# Altium project ADC_HUB.PrjPcb
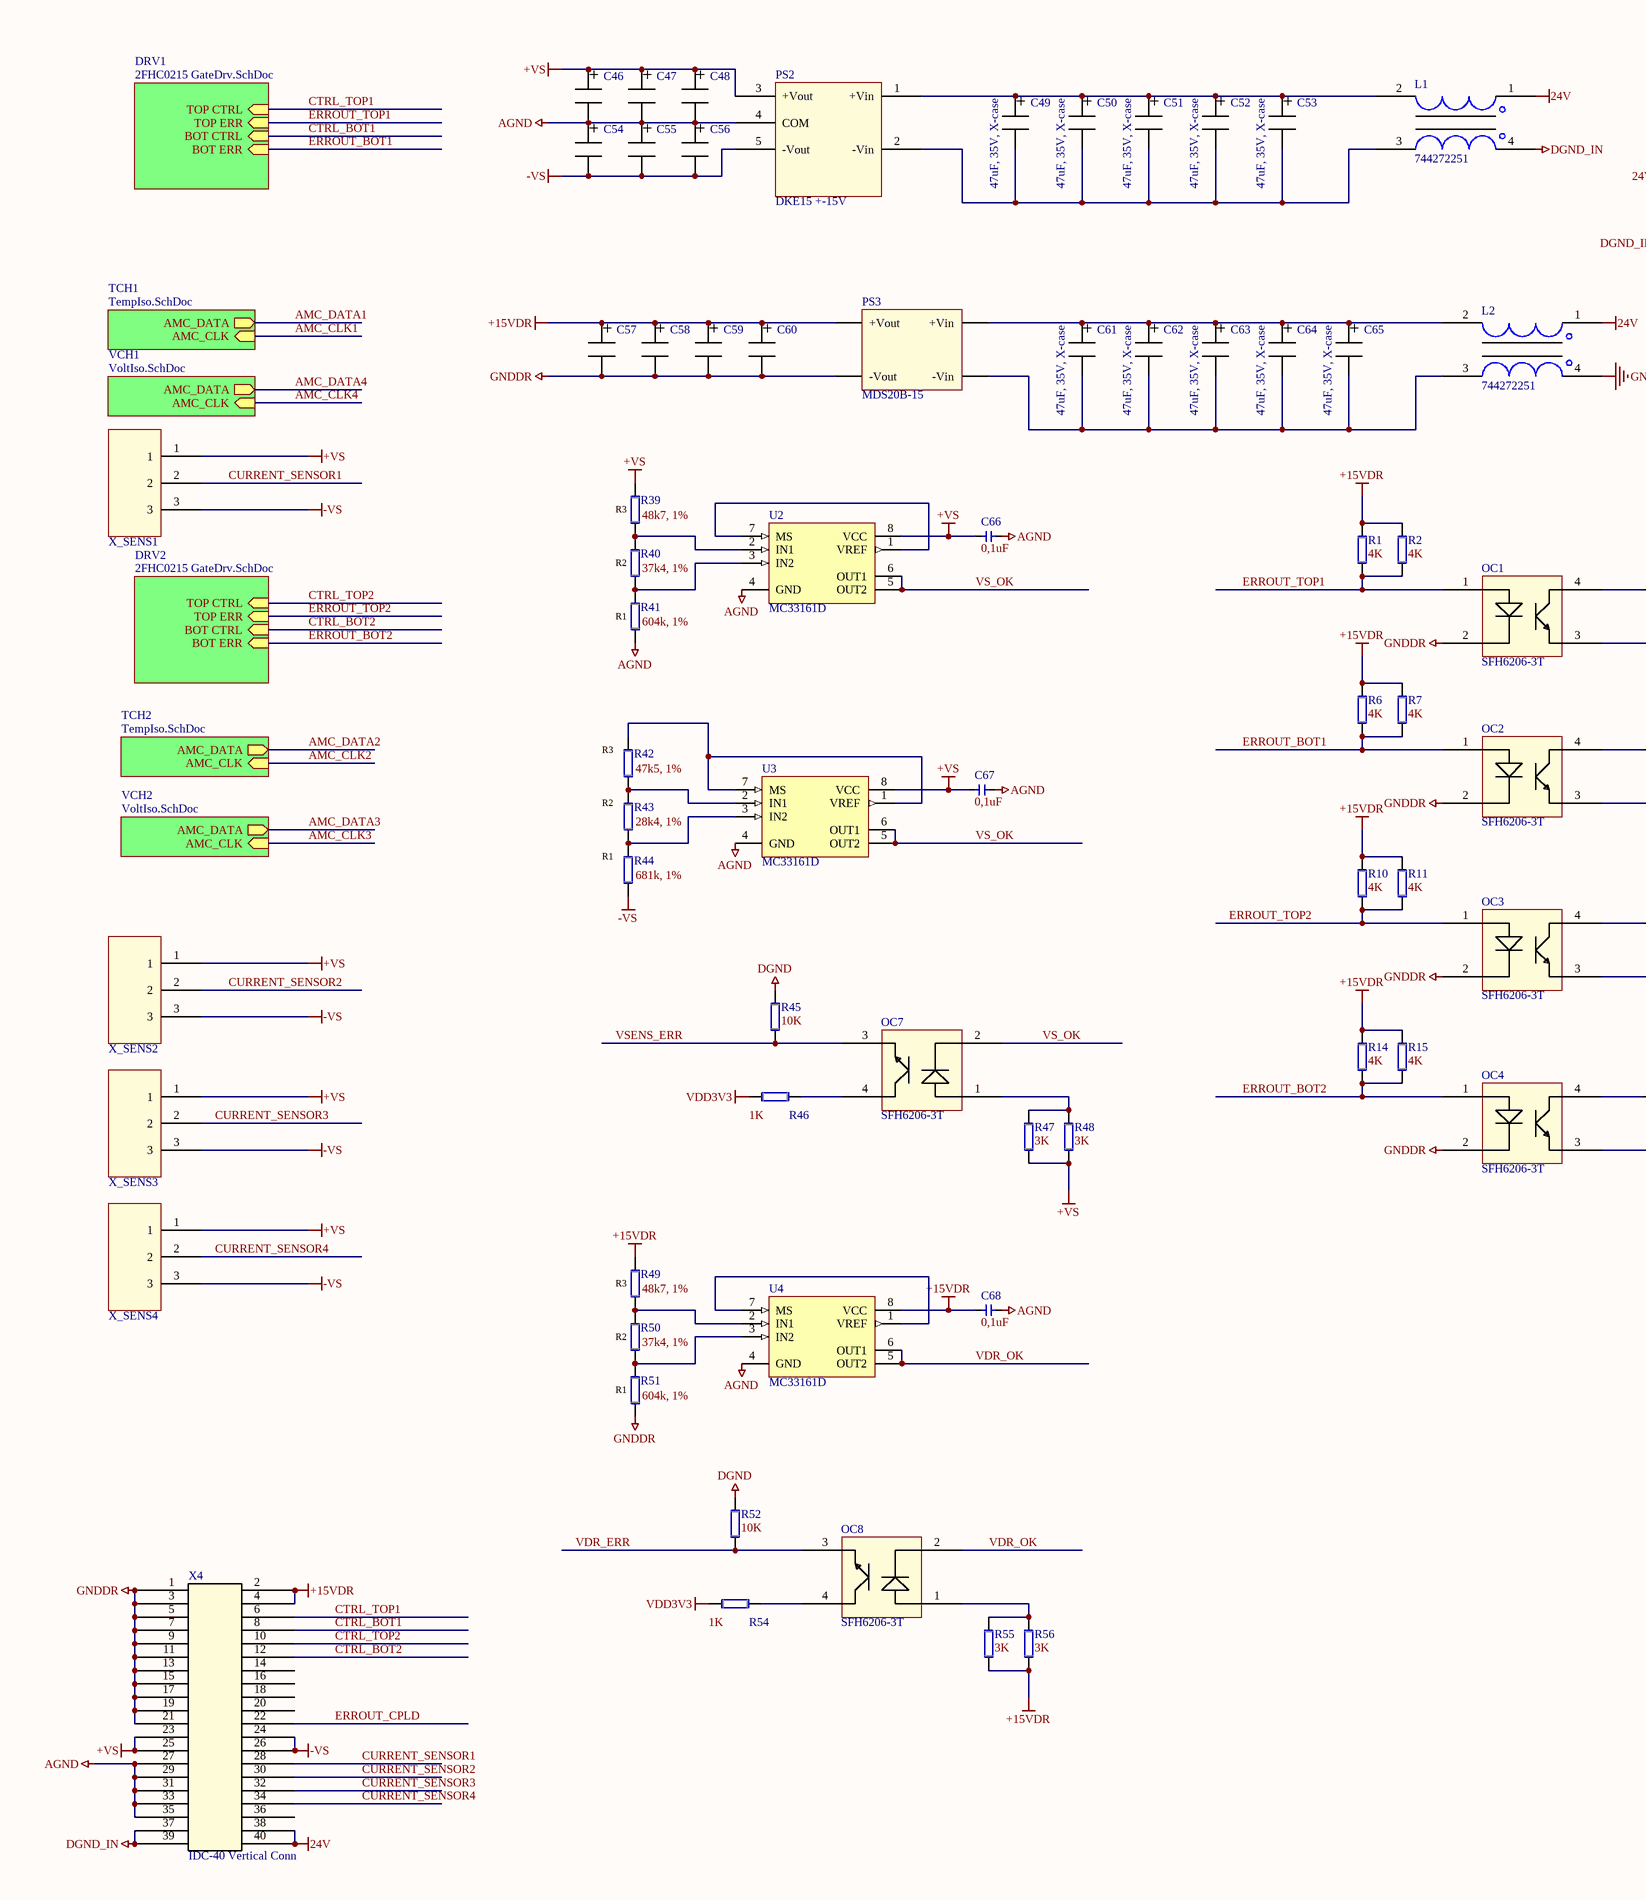
[diagram p0: ADC_HUB.SchDoc, left]
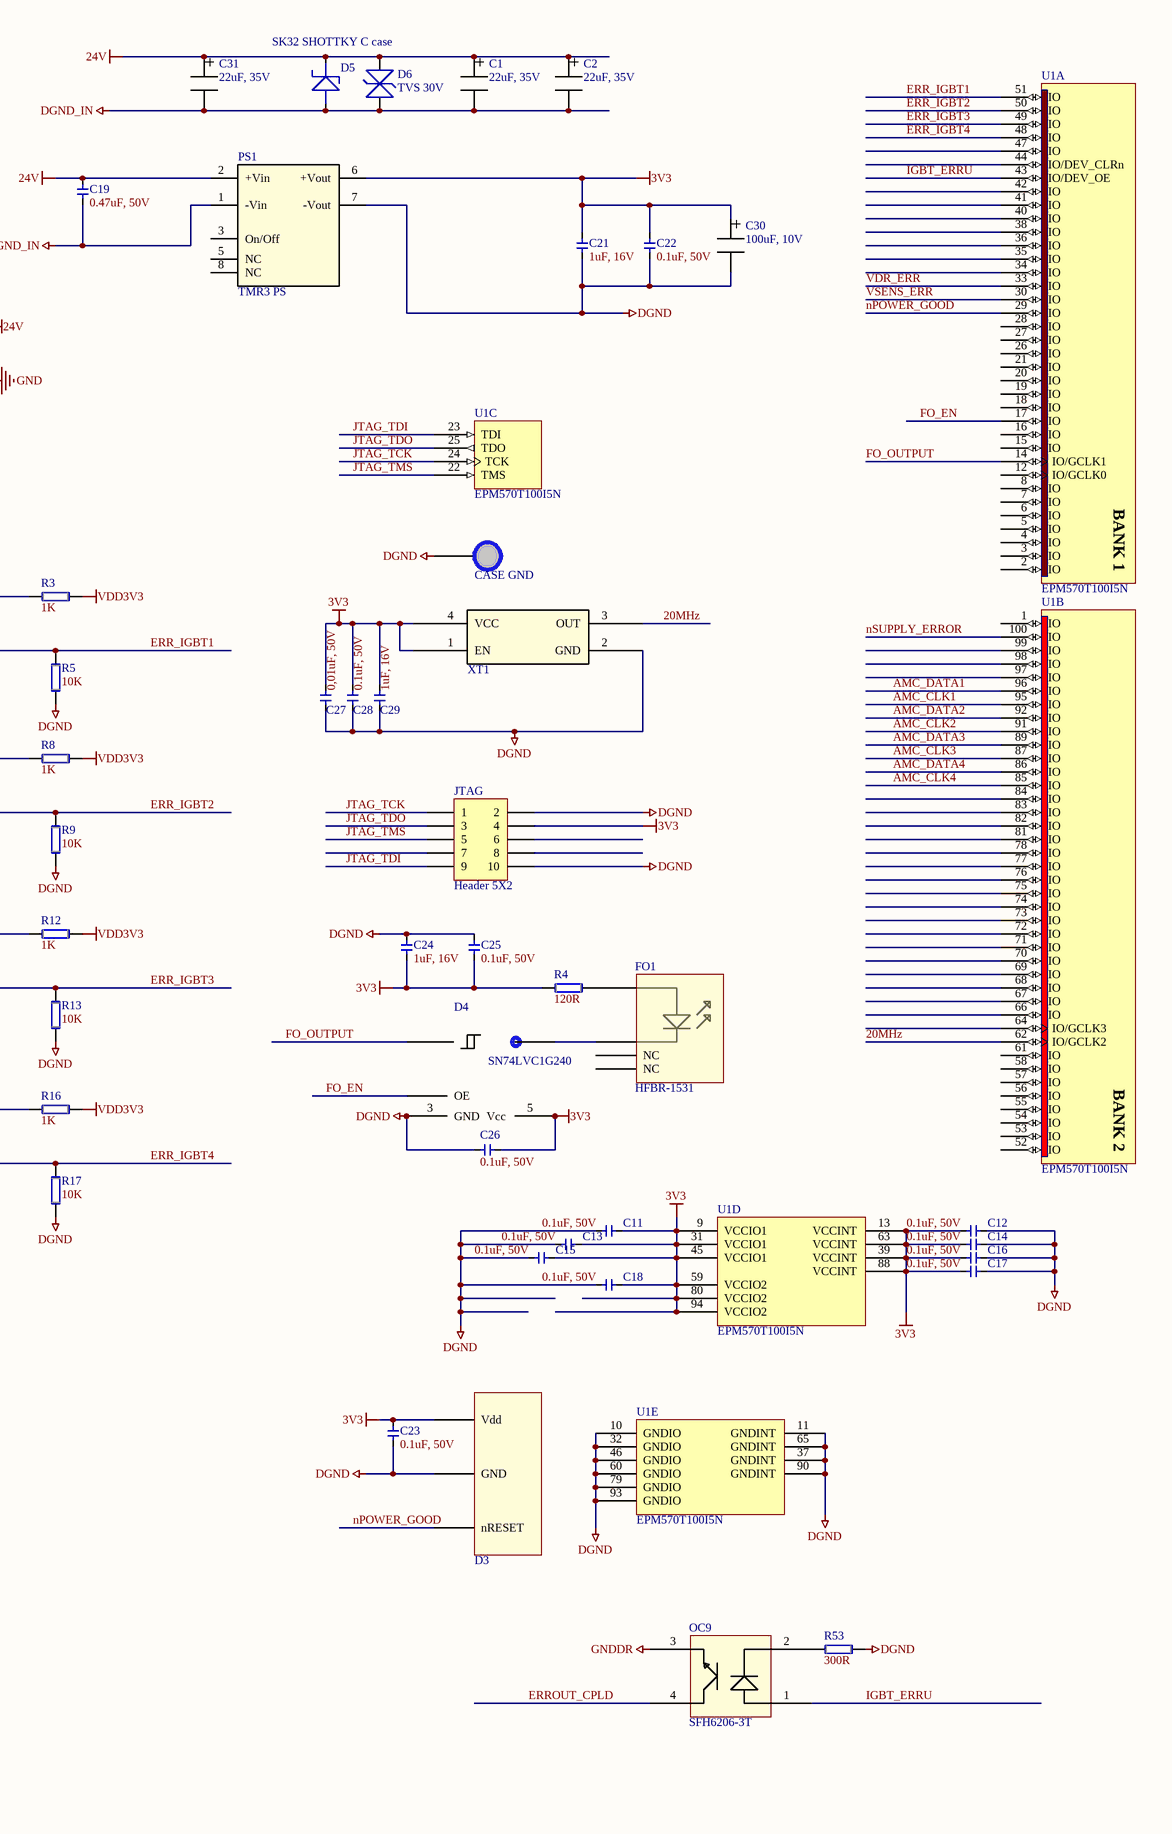
[diagram p1: ADC_HUB.SchDoc, right]
1 sheet, 109 parts. Net scope: hierarchical (ports join the sheet entries above them; power ports are global).
Board file: ADC_HUB.PcbDoc

## Sheet ADC_HUB.SchDoc
size A2

### Parts
C1  value 22uF, 35V  [D]  (hidden comment: Tant Cap D-case)
C2  value 22uF, 35V  [D]  (hidden comment: Tant Cap D-case)
C11  value 0.1uF, 50V  [SMD CAP 0805]  (hidden comment: ChipCap)
C12  value 0.1uF, 50V  [SMD CAP 0805]  (hidden comment: ChipCap)
C13  value 0.1uF, 50V  [SMD CAP 0805]  (hidden comment: ChipCap)
C14  value 0.1uF, 50V  [SMD CAP 0805]  (hidden comment: ChipCap)
C15  value 0.1uF, 50V  [SMD CAP 0805]  (hidden comment: ChipCap)
C16  value 0.1uF, 50V  [SMD CAP 0805]  (hidden comment: ChipCap)
C17  value 0.1uF, 50V  [SMD CAP 0805]  (hidden comment: ChipCap)
C18  value 0.1uF, 50V  [SMD CAP 0805]  (hidden comment: ChipCap)
C19  value 0.47uF, 50V  [SMD CAP 0805]  (hidden comment: ChipCap)
C21  value 1uF, 16V  [SMD CAP 0805]  (hidden comment: ChipCap)
C22  value 0.1uF, 50V  [SMD CAP 0805]  (hidden comment: ChipCap)
C23  value 0.1uF, 50V  [SMD CAP 0805]  (hidden comment: ChipCap)
C24  value 1uF, 16V  [SMD CAP 0805]  (hidden comment: ChipCap)
C25  value 0.1uF, 50V  [SMD CAP 0805]  (hidden comment: ChipCap)
C26  value 0.1uF, 50V  [SMD CAP 0805]  (hidden comment: ChipCap)
C27  value 0,01uF, 50V  [SMD CAP 0805]  (hidden comment: ChipCap)
C28  value 0.1uF, 50V  [SMD CAP 0805]  (hidden comment: ChipCap)
C29  value 1uF, 16V  [SMD CAP 0805]  (hidden comment: ChipCap)
C30  value 100uF, 10V  [D]  (hidden comment: Tant Cap D-case)
C31  value 22uF, 35V  [D]  (hidden comment: Tant Cap D-case)
C46  Tant Cap D-case  [D]  (value not drawn)
C47  Tant Cap D-case  [D]  (value not drawn)
C48  Tant Cap D-case  [D]  (value not drawn)
C49  value 47uF, 35V, X-case  [X]  (hidden comment: Tant Cap D-case)
C50  value 47uF, 35V, X-case  [X]  (hidden comment: Tant Cap D-case)
C51  value 47uF, 35V, X-case  [X]  (hidden comment: Tant Cap D-case)
C52  value 47uF, 35V, X-case  [X]  (hidden comment: Tant Cap D-case)
C53  value 47uF, 35V, X-case  [X]  (hidden comment: Tant Cap D-case)
C54  Tant Cap D-case  [D]  (value not drawn)
C55  Tant Cap D-case  [D]  (value not drawn)
C56  Tant Cap D-case  [D]  (value not drawn)
C57  Tant Cap D-case  [D]  (value not drawn)
C58  Tant Cap D-case  [D]  (value not drawn)
C59  Tant Cap D-case  [D]  (value not drawn)
C60  Tant Cap D-case  [D]  (value not drawn)
C61  value 47uF, 35V, X-case  [X]  (hidden comment: Tant Cap D-case)
C62  value 47uF, 35V, X-case  [X]  (hidden comment: Tant Cap D-case)
C63  value 47uF, 35V, X-case  [X]  (hidden comment: Tant Cap D-case)
C64  value 47uF, 35V, X-case  [X]  (hidden comment: Tant Cap D-case)
C65  value 47uF, 35V, X-case  [X]  (hidden comment: Tant Cap D-case)
C66  value 0,1uF  [SMD CAP 0603]  (hidden comment: ChipCap)
C67  value 0,1uF  [SMD CAP 0603]  (hidden comment: ChipCap)
C68  value 0,1uF  [SMD CAP 0603]  (hidden comment: ChipCap)
CASE_GND  PAD 3mm  [PAD3mm]  (value not drawn)
D3  TPS3809  [TPS3809]  (value not drawn)
D4  SN74LVC1G240  [TI-SOT23 SOT95P280X145-5N]
D5  SK32 SHOTTKY C case  [SMC DIODE]
D6  TVS 30V  [SMB TVS]
FO1  HFBR-1531  [1531/2531]
JTAG  Header 5X2  [HDR2X5]
L1  value 744272251  [744272251]  (hidden comment: Wurth EMI Choke)
L2  value 744272251  [744272251]  (hidden comment: Wurth EMI Choke)
OC1  SFH6206-3T  [SFH6206-3T]
OC2  SFH6206-3T  [SFH6206-3T]
OC3  SFH6206-3T  [SFH6206-3T]
OC4  SFH6206-3T  [SFH6206-3T]
OC7  SFH6206-3T  [SFH6206-3T]
OC8  SFH6206-3T  [SFH6206-3T]
OC9  SFH6206-3T  [SFH6206-3T]
PS1  TMR3 PS  [TMR3 TRACO]
PS2  value DKE15 +-15V  [DKE15]  (hidden comment: DKE 15 PS)
PS3  MDS20B-15  [MDS20B-15]
R1  value 4K  [R1206]  (hidden comment: Rsize)
R2  value 4K  [R1206]  (hidden comment: Rsize)
R3  value 1K  [SMD RES 0805]  (hidden comment: Rsize)
R4  value 120R  [SMD RES 0805]  (hidden comment: Rsize)
R5  value 10K  [SMD RES 0805]  (hidden comment: Rsize)
R6  value 4K  [R1206]  (hidden comment: Rsize)
R7  value 4K  [R1206]  (hidden comment: Rsize)
R8  value 1K  [SMD RES 0805]  (hidden comment: Rsize)
R9  value 10K  [SMD RES 0805]  (hidden comment: Rsize)
R10  value 4K  [R1206]  (hidden comment: Rsize)
R11  value 4K  [R1206]  (hidden comment: Rsize)
R12  value 1K  [SMD RES 0805]  (hidden comment: Rsize)
R13  value 10K  [SMD RES 0805]  (hidden comment: Rsize)
R14  value 4K  [R1206]  (hidden comment: Rsize)
R15  value 4K  [R1206]  (hidden comment: Rsize)
R16  value 1K  [SMD RES 0805]  (hidden comment: Rsize)
R17  value 10K  [SMD RES 0805]  (hidden comment: Rsize)
R39  value 48k7, 1%  [SMD RES 0603]  (hidden comment: Rsize)
R40  value 37k4, 1%  [SMD RES 0603]  (hidden comment: Rsize)
R41  value 604k, 1%  [SMD RES 0603]  (hidden comment: Rsize)
R42  value 47k5, 1%  [SMD RES 0603]  (hidden comment: Rsize)
R43  value 28k4, 1%  [SMD RES 0603]  (hidden comment: Rsize)
R44  value 681k, 1%  [SMD RES 0603]  (hidden comment: Rsize)
R45  value 10K  [SMD RES 0805]  (hidden comment: Rsize)
R46  value 1K  [SMD RES 0805]  (hidden comment: Rsize)
R47  value 3K  [R1206]  (hidden comment: Rsize)
R48  value 3K  [R1206]  (hidden comment: Rsize)
R49  value 48k7, 1%  [SMD RES 0603]  (hidden comment: Rsize)
R50  value 37k4, 1%  [SMD RES 0603]  (hidden comment: Rsize)
R51  value 604k, 1%  [SMD RES 0603]  (hidden comment: Rsize)
R52  value 10K  [SMD RES 0805]  (hidden comment: Rsize)
R53  value 300R  [R1206]  (hidden comment: Rsize)
R54  value 1K  [SMD RES 0805]  (hidden comment: Rsize)
R55  value 3K  [R1206]  (hidden comment: Rsize)
R56  value 3K  [R1206]  (hidden comment: Rsize)
U1  EPM570T100I5N  [TQFP100_N]  (parts A,B,C,D,E of 5)
U2  MC33161D  [751-05_N]
U3  MC33161D  [751-05_N]
U4  MC33161D  [751-05_N]
X4  IDC-40 Vertical Conn  [IDC2.54-V40]
X_SENS1  Connector 3.5mm  [15EDGRC-3.5 3P]  (value not drawn)
X_SENS2  Connector 3.5mm  [15EDGRC-3.5 3P]  (value not drawn)
X_SENS3  Connector 3.5mm  [15EDGRC-3.5 3P]  (value not drawn)
X_SENS4  Connector 3.5mm  [15EDGRC-3.5 3P]  (value not drawn)
XT1  Crystal generator  [OSC3225 YXC]  (value not drawn)

### Sub-sheets
DRV1 = 2FHC0215 GateDrv.SchDoc (file not in this document): BOT CTRL (in), TOP CTRL (in), TOP ERR (in), BOT ERR (in)
DRV2 = 2FHC0215 GateDrv.SchDoc (file not in this document): BOT CTRL (in), TOP CTRL (in), TOP ERR (in), BOT ERR (in)
TCH1 = TempIso.SchDoc (file not in this document): AMC_DATA (out), AMC_CLK (in)
TCH2 = TempIso.SchDoc (file not in this document): AMC_DATA (out), AMC_CLK (in)
VCH1 = VoltIso.SchDoc (file not in this document): AMC_DATA (out), AMC_CLK (in)
VCH2 = VoltIso.SchDoc (file not in this document): AMC_DATA (out), AMC_CLK (in)

### Nets
3V3: C11.1 C12.2 C13.1 C14.2 C15.1 C16.2 C17.2 C18.1 C21.1 C22.1 C23.1 C24.2 C25.2 C26.2 C27.1 C28.1 C29.1 C30.1 D3.3(Vdd) D4.5(Vcc) JTAG.4 PS1.6(+Vout) R4.2 U1.9(VCCIO1) U1.13(VCCINT) U1.31(VCCIO1) U1.39(VCCINT) U1.45(VCCIO1) U1.59(VCCIO2) U1.63(VCCINT) U1.80(VCCIO2) U1.88(VCCINT) U1.94(VCCIO2) XT1.1(EN) XT1.4(VCC)
24V: C1.1 C2.1 C19.1 C31.1 D5.K D6.2 L1.1 L2.1 PS1.2(+Vin) X4.38 X4.40
+15VDR: C57.1 C58.1 C59.1 C60.1 C68.2 PS3.3(+Vout) R1.1 R2.1 R6.1 R7.1 R10.1 R11.1 R14.1 R15.1 R49.1 R55.1 R56.1 U4.8(VCC) X4.2 X4.4
+VS: C46.1 C47.1 C48.1 C66.2 C67.2 PS2.3(+Vout) R39.1 R47.1 R48.1 U2.8(VCC) U3.8(VCC) X4.23 X4.25 X_SENS1.1 X_SENS2.1 X_SENS3.1 X_SENS4.1
-VS: C54.2 C55.2 C56.2 PS2.5(-Vout) R44.2 X4.24 X4.26 X_SENS1.3 X_SENS2.3 X_SENS3.3 X_SENS4.3
AGND: C46.2 C47.2 C48.2 C54.1 C55.1 C56.1 C66.1 C67.1 C68.1 PS2.4(COM) R41.2 U2.4(GND) U3.4(GND) U4.4(GND) X4.27 X4.29 X4.31 X4.33 X4.35
DGND: C11.2 C12.1 C13.2 C14.1 C15.2 C16.1 C17.1 C18.2 C21.2 C22.2 C23.2 C24.1 C25.1 C26.1 C27.2 C28.2 C29.2 C30.2 CASE_GND.1 D3.1(GND) D4.3(GND) JTAG.2 JTAG.10 PS1.7(-Vout) R5.1 R9.1 R13.1 R17.1 R45.1 R52.1 R53.1 U1.10(GNDIO) U1.11(GNDINT) U1.32(GNDIO) U1.37(GNDINT) U1.46(GNDIO) U1.60(GNDIO) U1.65(GNDINT) U1.79(GNDIO) U1.90(GNDINT) U1.93(GNDIO) XT1.2(GND)
DGND_IN: C1.2 C2.2 C19.2 C31.2 D5.A D6.1 L1.4 PS1.1(-Vin) X4.37 X4.39
GND: L2.4
GNDDR: C57.2 C58.2 C59.2 C60.2 OC1.2 OC2.2 OC3.2 OC4.2 OC9.3 PS3.5(-Vout) R51.2 X4.1 X4.3 X4.5 X4.7 X4.9 X4.11 X4.13 X4.15 X4.17 X4.19 X4.21
VDD3V3: R3.2 R8.2 R12.2 R16.2 R46.2 R54.2
20MHz: U1.62(IO/GCLK2) XT1.3(OUT)
AMC_CLK1: U1.95(IO) ; sheet TCH1/AMC_CLK
AMC_CLK2: U1.91(IO) ; sheet TCH2/AMC_CLK
AMC_CLK3: U1.87(IO) ; sheet VCH2/AMC_CLK
AMC_CLK4: U1.85(IO) ; sheet VCH1/AMC_CLK
AMC_DATA1: U1.96(IO) ; sheet TCH1/AMC_DATA
AMC_DATA2: U1.92(IO) ; sheet TCH2/AMC_DATA
AMC_DATA3: U1.89(IO) ; sheet VCH2/AMC_DATA
AMC_DATA4: U1.86(IO) ; sheet VCH1/AMC_DATA
CTRL_BOT1: X4.8 ; sheet DRV1/BOT CTRL
CTRL_BOT2: X4.12 ; sheet DRV2/BOT CTRL
CTRL_TOP1: X4.6 ; sheet DRV1/TOP CTRL
CTRL_TOP2: X4.10 ; sheet DRV2/TOP CTRL
CURRENT_SENSOR1: X4.28 X_SENS1.2
CURRENT_SENSOR2: X4.30 X_SENS2.2
CURRENT_SENSOR3: X4.32 X_SENS3.2
CURRENT_SENSOR4: X4.34 X_SENS4.2
ERR_IGBT1: OC1.3 R5.2 U1.51(IO)
ERR_IGBT2: OC2.3 R9.2 U1.50(IO)
ERR_IGBT3: OC3.3 R13.2 U1.49(IO)
ERR_IGBT4: OC4.3 R17.2 U1.48(IO)
ERROUT_BOT1: OC2.1 R6.2 R7.2 ; sheet DRV1/BOT ERR
ERROUT_BOT2: OC4.1 R14.2 R15.2 ; sheet DRV2/BOT ERR
ERROUT_CPLD: OC9.4 X4.22
ERROUT_TOP1: OC1.1 R1.2 R2.2 ; sheet DRV1/TOP ERR
ERROUT_TOP2: OC3.1 R10.2 R11.2 ; sheet DRV2/TOP ERR
FO_EN: D4.1(OE) U1.17(IO)
FO_OUTPUT: D4.2(A) U1.14(IO/GCLK1)
IGBT_ERRU: OC9.1 U1.43(IO/DEV_OE)
JTAG_TCK: JTAG.1 U1.24(TCK)
JTAG_TDI: JTAG.9 U1.23(TDI)
JTAG_TDO: JTAG.3 U1.25(TDO)
JTAG_TMS: JTAG.5 U1.22(TMS)
nPOWER_GOOD: D3.2(nRESET) U1.29(IO)
nSUPPLY_ERROR: U1.100(IO)
VDR_ERR: OC8.3 R52.2 U1.33(IO)
VDR_OK: OC8.2 U4.5(OUT2) U4.6(OUT1)
VS_OK: OC7.2 U2.5(OUT2) U2.6(OUT1) U3.5(OUT2) U3.6(OUT1)
VSENS_ERR: OC7.3 R45.2 U1.30(IO)
NetC49_1: C49.1 C50.1 C51.1 C52.1 C53.1 L1.2 PS2.1(+Vin)
NetC49_2: C49.2 C50.2 C51.2 C52.2 C53.2 L1.3 PS2.2(-Vin)
NetC61_1: C61.1 C62.1 C63.1 C64.1 C65.1 L2.2 PS3.1(+Vin)
NetC61_2: C61.2 C62.2 C63.2 C64.2 C65.2 L2.3 PS3.2(-Vin)
NetD4_4: D4.4(Y) FO1.2
NetFO1_1: FO1.1 R4.1
NetOC1_4: OC1.4 R3.1
NetOC2_4: OC2.4 R8.1
NetOC3_4: OC3.4 R12.1
NetOC4_4: OC4.4 R16.1
NetOC7_1: OC7.1 R47.2 R48.2
NetOC7_4: OC7.4 R46.1
NetOC8_1: OC8.1 R55.2 R56.2
NetOC8_4: OC8.4 R54.1
NetOC9_2: OC9.2 R53.2
NetR39_2: R39.2 R40.1 U2.2(IN1)
NetR40_2: R40.2 R41.1 U2.3(IN2)
NetR42_1: R42.1 U3.1(VREF) U3.7(MS)
NetR42_2: R42.2 R43.1 U3.2(IN1)
NetR43_2: R43.2 R44.1 U3.3(IN2)
NetR49_2: R49.2 R50.1 U4.2(IN1)
NetR50_2: R50.2 R51.1 U4.3(IN2)
NetU2_1: U2.1(VREF) U2.7(MS)
NetU4_1: U4.1(VREF) U4.7(MS)

Not connected (* = marked no-connect by the designer): FO1 3(NC) 4(NC); JTAG 6 7 8; PS1 3(On/Off) 5(NC) 8(NC); U1 1(IO) 2(IO) 3(IO) 4(IO) 5(IO) 6(IO) 7(IO) 8(IO) 12(IO/GCLK0) 15(IO) 16(IO) 18(IO) 19(IO) 20(IO) 21(IO) 26(IO) 27(IO) 28(IO) 34(IO) 35(IO) 36(IO) 38(IO) 40(IO) 41(IO) 42(IO) 44(IO/DEV_CLRn) 47(IO) 52(IO) 53(IO) 54(IO) 55(IO) 56(IO) 57(IO) 58(IO) 61(IO) 64(IO/GCLK3) 66(IO) 67(IO) 68(IO) 69(IO) 70(IO) 71(IO) 72(IO) 73(IO) 74(IO) 75(IO) 76(IO) 77(IO) 78(IO) 81(IO) 82(IO) 83(IO) 84(IO) 97(IO) 98(IO) 99(IO); X4 14 16 18 20 36

### Notes on the sheet
- (near R39) R3
- (near R41) R1
- (near R40) R2
- (near R42) R3
- R2
- R1
- (near R49) R3
- (near R50) R2
- (near R51) R1
- (in symbol EPM570T100I5N, part A) BANK 1
- (in symbol EPM570T100I5N, part B) BANK 2

### Library data of the parts
C1 C2 C30 C31 C49-C53 C61-C65 = C
C11-C19 C21-C29 C66-C68 = ChipCapacitor
C46-C48 C54-C60 = C: Value: 100uF, 25V, D-case
D3 = TPS3809: Voltage Supervisor
D4 = SN74LVC1G240: Inverted Schmitt Trigger with EN; Value: SN74LVC1G240
D5 = SK32 SHOTTKY
D6 = SMB TVS BiDir
FO1 = HFBR-1531: Fiber Optical Transmitter
JTAG = Header 5X2: Header, 5-Pin, Dual row; Rule: UNIONINDEX{}0[]RULEKIND{}PlaneConnect[]NETSCOPE{}AnyNet[]LAYERKIND{}SameLayer[]NAME{}Schematic Power Plane Connect Style[]PLANECONNECTSTYLE{}Relief[]RELIEFEXPANSION{}15.748mil[]RELIEFENTRIES{}4[]RELIEFCONDUCTORWIDTH{}15.748mil[]RELIEFAIRGAP{}15.748mil[]UNIT{}Imperial[]PcbType{}ProtelPcb; LatestRevisionDate: 17-Jul-2002; LatestRevisionNote: Re-released for DXP Platform.; Publisher: Altium Limited
L1 L2 = Wurth EMI Choke 744272251
OC1-OC4 OC7-OC9 = SFH6206-3T: SFH6206-3T Optocoupler; Value: SFH6206-3T
PS1 = TMR3 TRACO: TMR3 power supply; Value: *
PS2 = DKE15 PS: DKE 15 MW Power Supply
PS3 = MDS20B-15: MDS20B-15  power supply 15V; Value: MDS20B-15
R1-R17 R39-R56 = ChipResistor
U1 = EPM570T100I5N: MAX II 3.3/2.5V CPLD, 76 IOs, 570 Logic Elements, 100-Pin Plastic TQFP, Industrial Temperature, Speed Grade 5, Pb-Free; Note: Each set of VCCIO pins can be connected to 3.3V, 2.5V, 1.8V, or 1.5V.; Note: All VCCINT pins must be connected to either 3.3V or 2.5V (but not a combination of both).; Published: 18-Aug-2005; LatestRevisionDate: 13-Apr-2006; LatestRevisionNote: IPC-7351 Footprint Added.; DatasheetVersion: ver1.8, Jul-2006; PackageVersion: ver15.1, May-2008; PackageReference: TQFP100; Publisher: Altium Limited; PackageDescription: 100-Pin Plastic Thin Quad Flat Pack (TQFP100) - Wire Bond; Supplier 1: Digi-Key; Supplier Part Number 1: 544-2281-ND; Supplier 2: Farnell; Supplier Part Number 2: 1549471; Code_JEDEC: MS-026-AED; ComponentLink1Description: Manufacturer Link; ComponentLink1URL: http://www.altera.com/products/devices/cpld/max2/mx2-index.jsp; ComponentLink2Description: Handbook; ComponentLink2URL: http://www.altera.com/literature/hb/max2/max2_mii5v1.pdf; ComponentLink3Description: Packaging Specification; ComponentLink3URL: http://www.altera.com/literature/ds/dspkg.pdf
U2-U4 = MC33161D: Universal Voltage Monitor; Published: 15-Apr-2002; LatestRevisionDate: 13-Apr-2006; LatestRevisionNote: IPC-7351 Footprint Added.; DatasheetVersion: Apr-2000; PackageVersion: 1998; PackageReference: 751-05; Publisher: Altium Limited; PackageDescription: 8-Pin Small Outline Integrated Circuit 1.27 mm Pitch; Code_JEDEC: MS-012-AA; Code_IPC: SOIC127P600-8; ComponentLink1Description: Manufacturer Link; ComponentLink1URL: http://www.onsemi.com/site/products/taxonomy/0,4438,503,00.html; ComponentLink2Description: Datasheet; ComponentLink2URL: http://www.onsemi.com/pub/Collateral/MC34161-D.PDF
X4 = IDC-40: Value: IDC-40
X_SENS1-X_SENS4 = 15EDGRC-3.5 3P
XT1 = GEN 0532